# Altium schematic sheet CPU.SchDoc
size A4
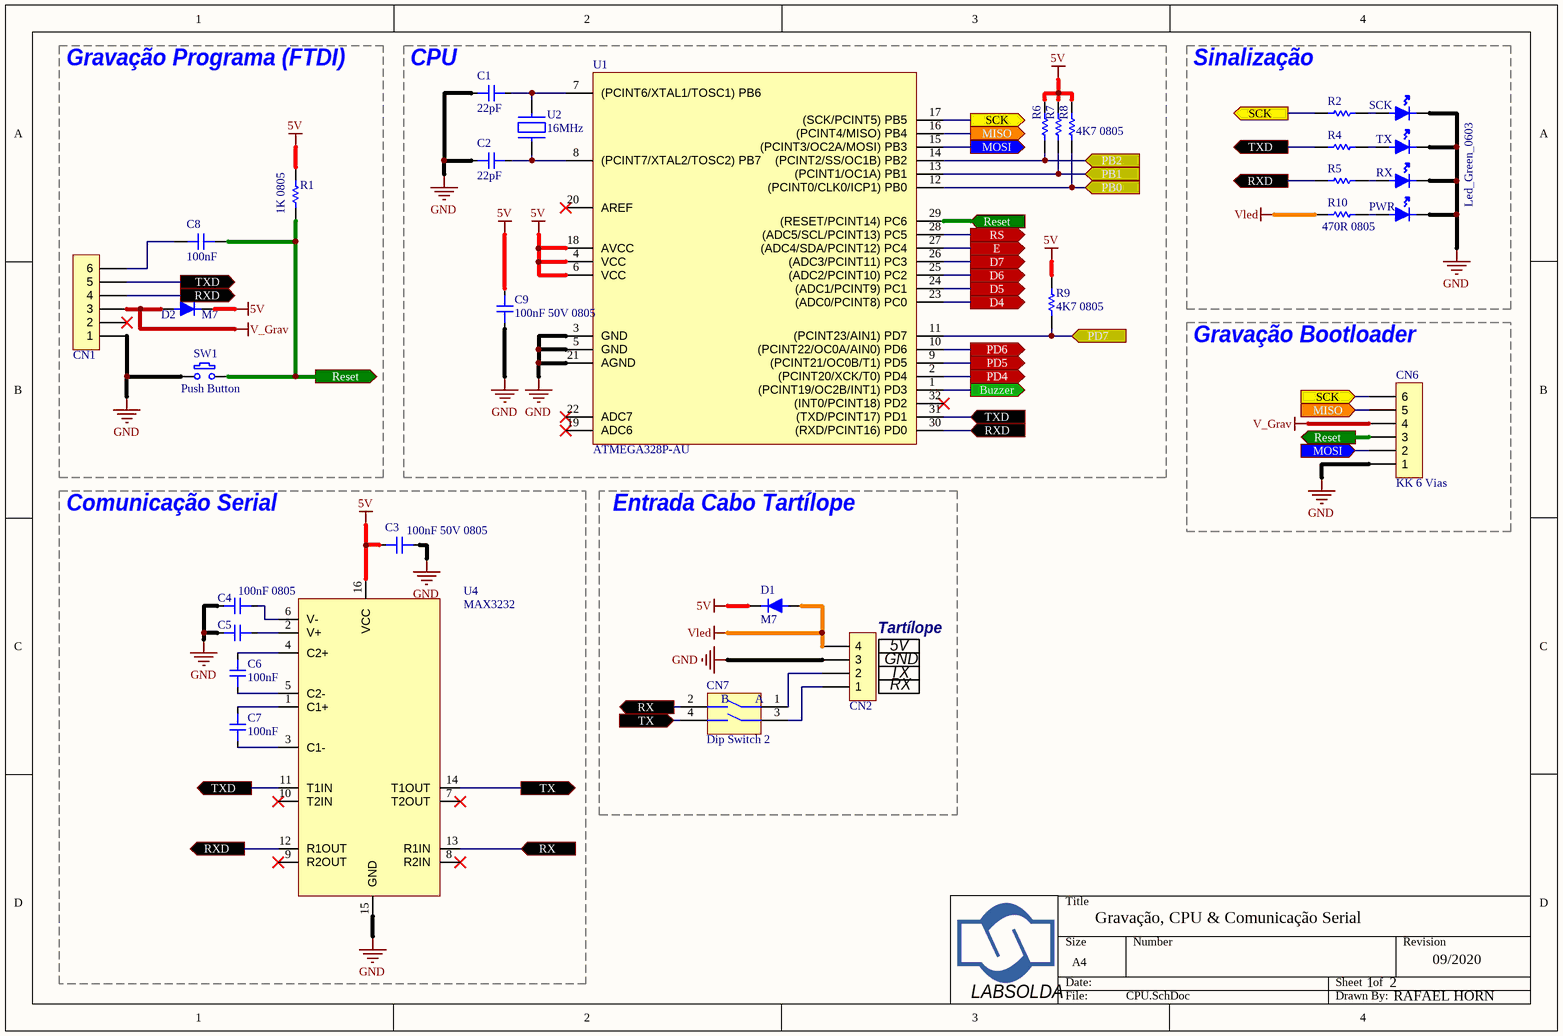
[diagram p0: CPU.SchDoc]

## Parts
C1  22pF  [100nF 0805]
C2  22pF  [100nF 0805]
C3  100nF 50V 0805  [100nF 0805]
C4  100nF 50V 0805  [100nF 0805]  (value not drawn)
C5  100nF 0805  [100nF 0805]
C6  100nF  [100nF 0805]
C7  100nF  [100nF 0805]
C8  100nF  [5mm film]
C9  100nF 50V 0805  [100nF 0805]
CN1  Barra Pinos M  [Barra Pino M 6]  (value not drawn)
CN2  STLZ 4 Vias  [STLZ 4 5.08mm]  (value not drawn)
CN6  KK 6 Vias  [KK_6W_.100]
CN7  Dip Switch 2  [DIP_SWITCH_2]
D1  M7  [DO-214AC SMA]
D2  M7  [DO-214AC SMA]
PWR  Green_0603  [Green Led 0603]  (value not drawn)
R1  1K 0805  [0805 - 1K 1%]
R2  470R 0805  [0805 - 470R 1%]  (value not drawn)
R4  470R 0805  [0805 - 470R 1%]  (value not drawn)
R5  470R 0805  [0805 - 470R 1%]  (value not drawn)
R6  4K7  [0805 - 2k7 1%]  (value not drawn)
R7  4K7  [0805 - 2k7 1%]  (value not drawn)
R8  4K7 0805  [0805 - 2k7 1%]
R9  4K7 0805  [0805 - 2k7 1%]
R10  470R 0805  [0805 - 470R 1%]
RX  Green_0603  [Green Led 0603]  (value not drawn)
SCK  Led_Green_0603  [Green Led 0603]
SW1  Push Button  [Chave Tactil 6x6x5]
TX  Green_0603  [Green Led 0603]  (value not drawn)
U1  ATMEGA328P-AU  [LQFP-32]
U2  16MHz  [HC49]
U4  MAX3232  [DIP16-300(100)]

## Blocks framed on the sheet
Gravação Programa (FTDI): C8 CN1 D2 R1 SW1
CPU: C1 C2 C9 R6-R9 U1 U2
Sinalização: PWR R2 R4 R5 R10 RX SCK TX
Gravação Bootloader: CN6
Comunicação Serial: C3-C7 U4
Entrada Cabo Tartílope: CN2 CN7 D1

## Ports
Buzzer (out), D4 (out), D5 (out), D6 (out), D7 (out), E (out), MISO (in), MISO (out), MOSI (in), MOSI (out), PB0 (in), PB1 (in), PB2 (in), PD4 (out), PD5 (out), PD6 (out), PD7 (in), Reset (in), Reset (out), RS (out), RX (in), RX (out), RXD (in), RXD (out), SCK (in), SCK (out), TX (in), TX (out), TXD (in), TXD (out)

## Nets
5V: C3.2 C9.2 D1.K D2.K R1.2 R6.2 R7.2 R8.2 R9.2 U1.4(VCC) U1.6(VCC) U1.18(AVCC) U4.16(VCC)
GND: C1.1 C2.1 C3.1 C4.1 C5.1 C9.1 CN1.1 CN2.3 CN6.1 PWR.K RX.K SCK.K SW1.1 TX.K U1.3(GND) U1.5(GND) U1.21(AGND) U4.15(GND)
V_Grav: CN1.3 CN6.4 D2.A
Vled: CN2.4 D1.A R10.1
Buzzer: U1.1((PCINT19/OC2B/INT1)_PD3) ; port Buzzer
D4: U1.23((ADC0/PCINT8)_PC0) ; port D4
D5: U1.24((ADC1/PCINT9)_PC1) ; port D5
D6: U1.25((ADC2/PCINT10)_PC2) ; port D6
D7: U1.26((ADC3/PCINT11)_PC3) ; port D7
E: U1.27((ADC4/SDA/PCINT12)_PC4) ; port E
MISO: CN6.5 U1.16((PCINT4/MISO)_PB4) ; port MISO
MOSI: CN6.2 U1.15((PCINT3/OC2A/MOSI)_PB3) ; port MOSI
PB0: R8.1 U1.12((PCINT0/CLK0/ICP1)_PB0) ; port PB0
PB1: R7.1 U1.13((PCINT1/OC1A)_PB1) ; port PB1
PB2: R6.1 U1.14((PCINT2/SS/OC1B)_PB2) ; port PB2
PD4: U1.2((PCINT20/XCK/T0)_PD4) ; port PD4
PD5: U1.9((PCINT21/OC0B/T1)_PD5) ; port PD5
PD6: U1.10((PCINT22/OC0A/AIN0)_PD6) ; port PD6
PD7: R9.1 U1.11((PCINT23/AIN1)_PD7) ; port PD7
Reset: C8.2 CN6.3 R1.1 SW1.2 U1.29((RESET/PCINT14)_PC6) ; port Reset
RS: U1.28((ADC5/SCL/PCINT13)_PC5) ; port RS
RX: CN7.2(1B) U4.13(R1IN) ; port RX
RXD: CN1.4 R5.1 U1.30((RXD/PCINT16)_PD0) U4.12(R1OUT) ; port RXD
SCK: CN6.6 R2.1 U1.17((SCK/PCINT5)_PB5) ; port SCK
TX: CN7.4(2B) U4.14(T1OUT) ; port TX
TXD: CN1.5 R4.1 U1.31((TXD/PCINT17)_PD1) U4.11(T1IN) ; port TXD
NetC1_2: C1.2 U1.7((PCINT6/XTAL1/TOSC1)_PB6) U2.1
NetC2_2: C2.2 U1.8((PCINT7/XTAL2/TOSC2)_PB7) U2.2
NetC4_2: C4.2 U4.6(V-)
NetC5_2: C5.2 U4.2(V+)
NetC6_1: C6.1 U4.5(C2-)
NetC6_2: C6.2 U4.4(C2+)
NetC7_1: C7.1 U4.3(C1-)
NetC7_2: C7.2 U4.1(C1+)
NetC8_1: C8.1 CN1.6
NetCN2_1: CN2.1 CN7.3(2A)
NetCN2_2: CN2.2 CN7.1(1A)
NetPWR_A: PWR.A R10.2
NetR2_2: R2.2 SCK.A
NetR4_2: R4.2 TX.A
NetR5_2: R5.2 RX.A

Not connected (* = marked no-connect by the designer): CN1 2*; U1 19(ADC6)* 20(AREF)* 22(ADC7)* 32((INT0/PCINT18)_PD2)*; U4 7(T2OUT)* 8(R2IN)* 9(R2OUT)* 10(T2IN)*

## Notes on the sheet
- (near CN2) Tartílope
- (near CN2) 5V
- (near CN2) GND
- (near CN2) TX
- (near CN2) RX
- Gravação, CPU & Comunicação Serial
- 1
- 2
- 09/2020
- LABSOLDA
- RAFAEL HORN
- (in symbol Dip Switch 2 Vias) B; A

## Library data of the parts
C1-C7 C9 = 100nF 16V 0805: Capacitor 0805 100nF 16V
C8 = 100nF 63V: FILM CAPACITORS 100nF 63V
CN1 = Barra Pino M 6: Barra Pino Macho 6 Vias 2.54mm
CN2 = STLZ 4 Vias: Conector Socket STLZ 4 Vias 5.08mm
CN6 = KK 6 Vias: Conector Placa KK 6 Vias 2.54mm
CN7 = Dip Switch 2 Vias: DIP Switches / SIP Switches Dip switch Slide Type; Partnumber: NDSR-02V; Manufacturer: Diptronics; Datasheet: https://br.mouser.com/datasheet/2/910/DS_1-1571341.pdf
D1 D2 = M7: 1A Rectifier Diodes
PWR RX SCK TX = Green 0603: LED GREEN CLEAR 0603 SMD PN 150060VS75000
R1 = 1K - 0805: Resistor SMD 0805 1K
R2 R4 R5 R10 = 470R - 0805: Resistor SMD 0805 470R
R6-R9 = 2K7 - 0805: Resistor SMD 0805 2K7
SW1 = Push Button: Chave Tactil 4 terminais 6x6x5mm - KFC-A06
U1 = ATMEGA328P: 8-bit AVR Microcontroller with 32K Bytes In-System  Programmable Flash
U2 = Crystal 16MHz: 16MHZ OSCILATOR CRYSTAL
U4 = MAX3232: MAX3232 3-V to 5.5-V Multichannel RS-232 Line Driver/Receiver  With ±15-kV ESD Protection